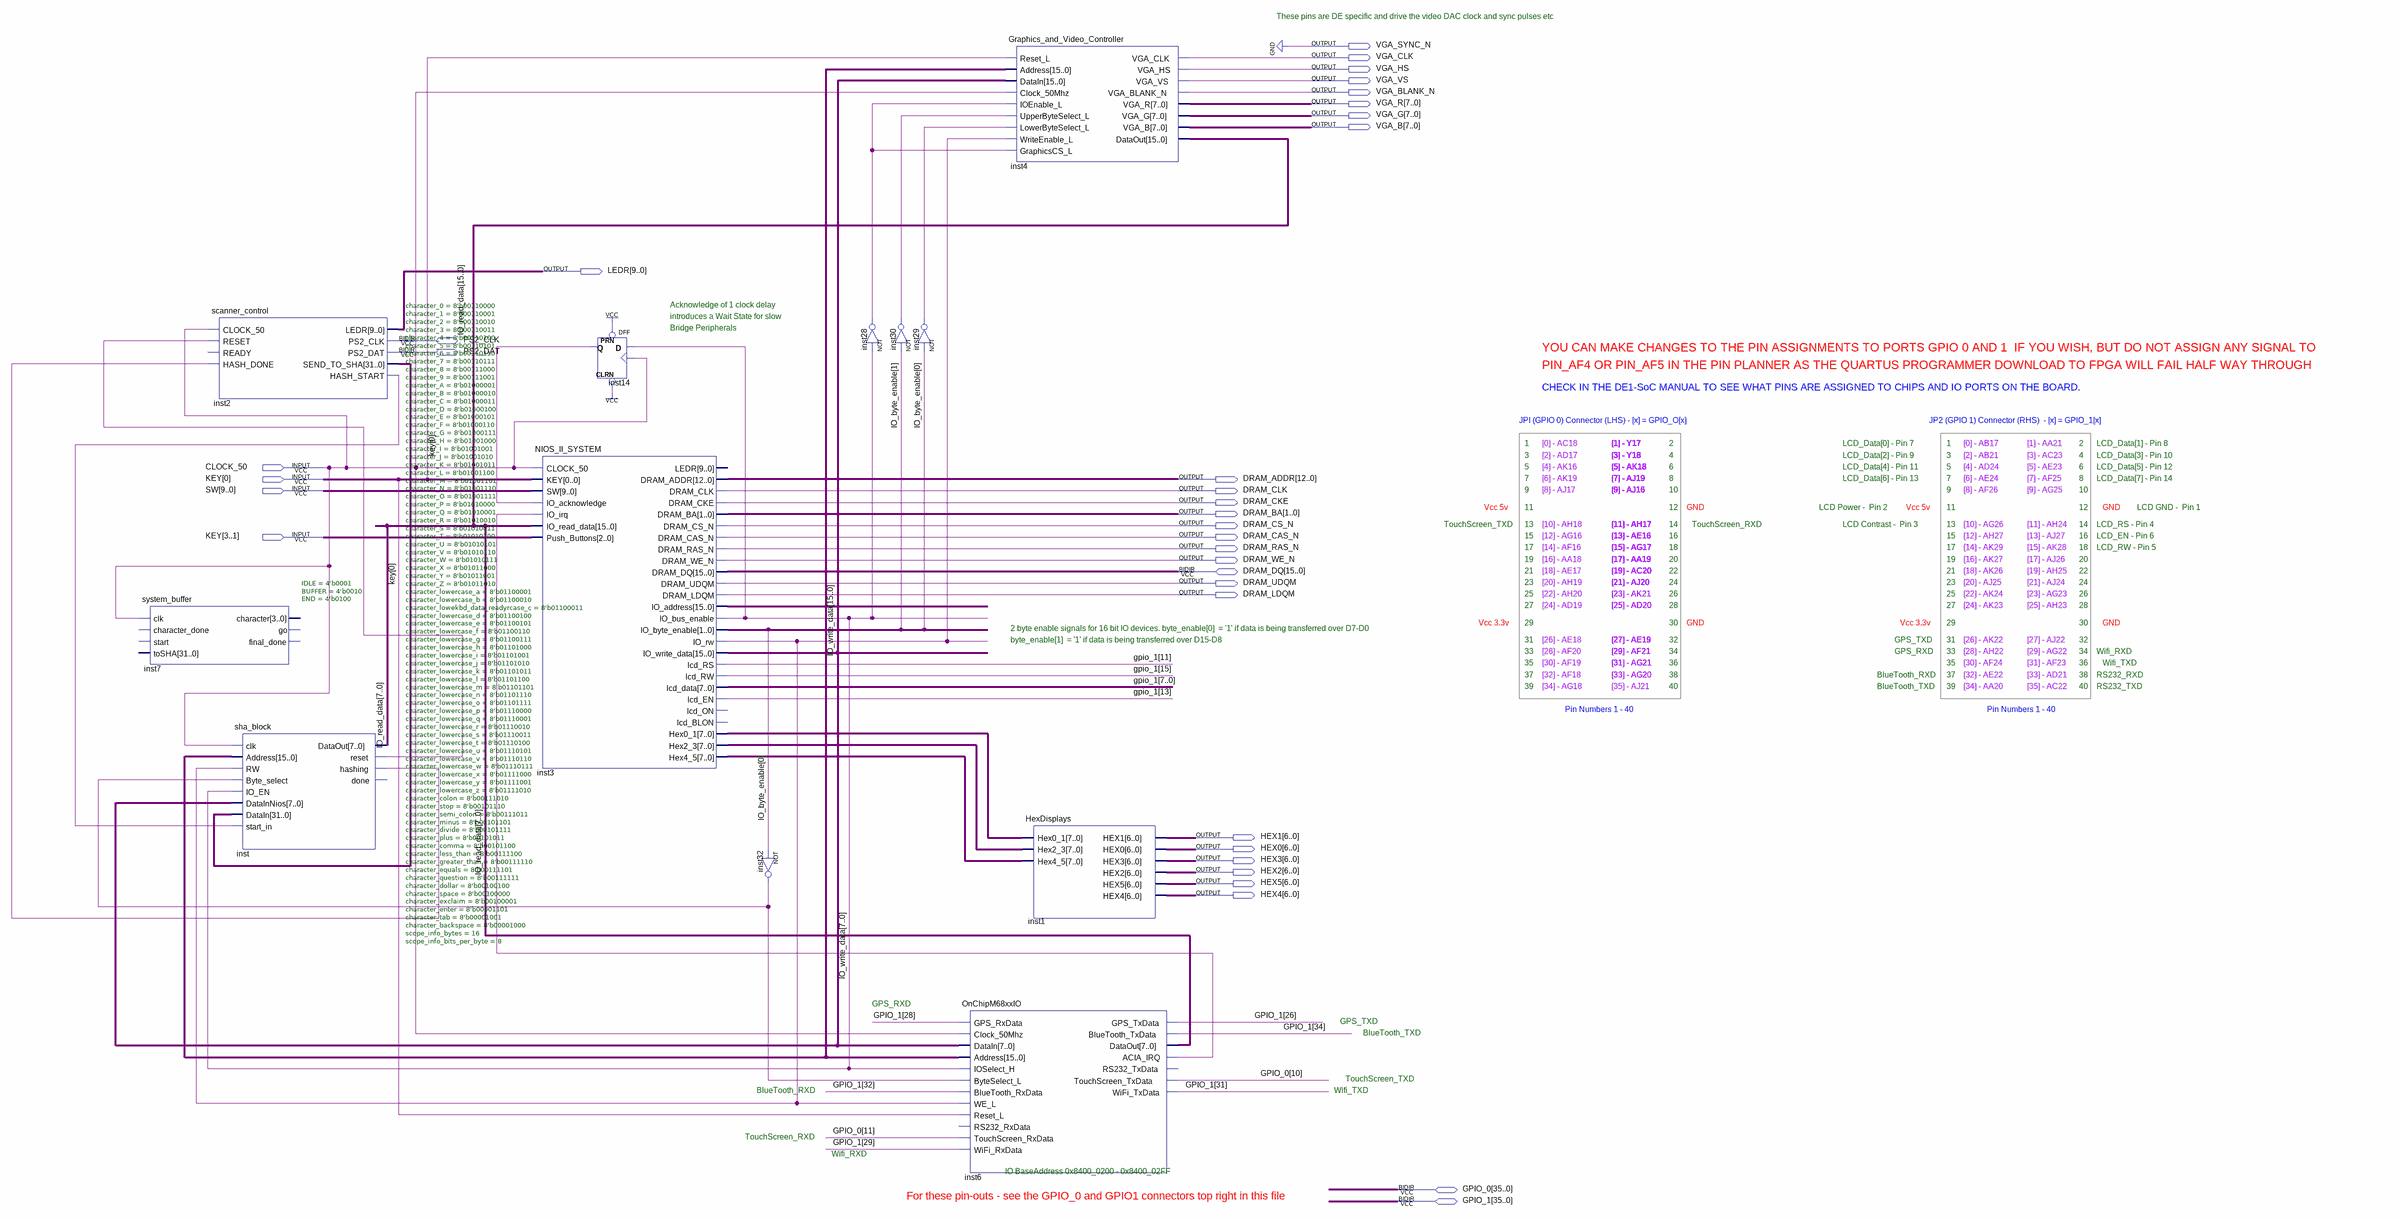
[diagram p0: schematic sheet]
// Quartus schematic Exercise14.bdf as structural Verilog: 12 symbols, 34 pins
module Exercise14 (
  input  CLOCK_50,
  input  [3:0] KEY,
  input  [9:0] SW,
  inout  PS2_CLK,
  inout  PS2_DAT,
  inout  [15:0] DRAM_DQ,
  inout  [35:0] GPIO_0,
  inout  [35:0] GPIO_1,
  output VGA_SYNC_N,
  output VGA_CLK,
  output VGA_HS,
  output VGA_VS,
  output VGA_BLANK_N,
  output [7:0] VGA_R,
  output [7:0] VGA_G,
  output [7:0] VGA_B,
  output [9:0] LEDR,
  output [12:0] DRAM_ADDR,
  output DRAM_CLK,
  output DRAM_CKE,
  output [1:0] DRAM_BA,
  output DRAM_CS_N,
  output DRAM_CAS_N,
  output DRAM_RAS_N,
  output DRAM_WE_N,
  output DRAM_UDQM,
  output DRAM_LDQM,
  output [6:0] HEX1,
  output [6:0] HEX0,
  output [6:0] HEX3,
  output [6:0] HEX2,
  output [6:0] HEX5,
  output [6:0] HEX4
);

  wire inst2_hash_start, inst3_io_bus_enable, inst3_io_rw, inst6_acia_irq, inst14_q, inst28_out, inst29_out,
       inst30_out, inst32_out, inst_hashing, inst_reset;
  wire [1:0] IO_byte_enable;
  wire [7:0] inst3_hex0_1, inst3_hex2_3, inst3_hex4_5;
  wire [15:0] inst3_io_address, IO_read_data, IO_write_data;
  wire [31:0] inst2_send_to_sha;

  system_buffer #(.IDLE(4'b0001), .BUFFER(4'b0010), .END(4'b0100)) inst7 (.clk(CLOCK_50));  // open: character_done, start, toSHA, character, go, final_done
  scanner_control #(.character_0(8'b00110000), .character_1(8'b00110001), .character_2(8'b00110010), .character_3(8'b00110011), .character_4(8'b00110100), .character_5(8'b00110101), .character_6(8'b00110110), .character_7(8'b00110111), .character_8(8'b00111000), .character_9(8'b00111001), .character_A(8'b01000001), .character_B(8'b01000010), .character_C(8'b01000011), .character_D(8'b01000100), .character_E(8'b01000101), .character_F(8'b01000110), .character_G(8'b01000111), .character_H(8'b01001000), .character_I(8'b01001001), .character_J(8'b01001010), .character_K(8'b01001011), .character_L(8'b01001100), .character_M(8'b01001101), .character_N(8'b01001110), .character_O(8'b01001111), .character_P(8'b01010000), .character_Q(8'b01010001), .character_R(8'b01010010), .character_S(8'b01010011), .character_T(8'b01010100), .character_U(8'b01010101), .character_V(8'b01010110), .character_W(8'b01010111), .character_X(8'b01011000), .character_Y(8'b01011001), .character_Z(8'b01011010), .character_lowercase_a(8'b01100001), .character_lowercase_b(8'b01100010), .character_lowekbd_data_readyrcase_c(8'b01100011), .character_lowercase_d(8'b01100100), .character_lowercase_e(8'b01100101), .character_lowercase_f(8'b01100110), .character_lowercase_g(8'b01100111), .character_lowercase_h(8'b01101000), .character_lowercase_i(8'b01101001), .character_lowercase_j(8'b01101010), .character_lowercase_k(8'b01101011), .character_lowercase_l(8'b01101100), .character_lowercase_m(8'b01101101), .character_lowercase_n(8'b01101110), .character_lowercase_o(8'b01101111), .character_lowercase_p(8'b01110000), .character_lowercase_q(8'b01110001), .character_lowercase_r(8'b01110010), .character_lowercase_s(8'b01110011), .character_lowercase_t(8'b01110100), .character_lowercase_u(8'b01110101), .character_lowercase_v(8'b01110110), .character_lowercase_w(8'b01110111), .character_lowercase_x(8'b01111000), .character_lowercase_y(8'b01111001), .character_lowercase_z(8'b01111010), .character_colon(8'b00111010), .character_stop(8'b00101110), .character_semi_colon(8'b00111011), .character_minus(8'b00101101), .character_divide(8'b00101111), .character_plus(8'b00101011), .character_comma(8'b00101100), .character_less_than(8'b00111100), .character_greater_than(8'b00111110), .character_equals(8'b00111101), .character_question(8'b00111111), .character_dollar(8'b00100100), .character_space(8'b00100000), .character_exclaim(8'b00100001), .character_enter(8'b00001101), .character_tab(8'b00001001), .character_backspace(8'b00001000), .scope_info_bytes(16), .scope_info_bits_per_byte(8)) inst2 (
    .CLOCK_50(CLOCK_50), .RESET(inst_reset), .HASH_DONE(inst_hashing), .LEDR(LEDR),
    .SEND_TO_SHA(inst2_send_to_sha), .HASH_START(inst2_hash_start), .PS2_CLK(PS2_CLK), .PS2_DAT(PS2_DAT));  // open: READY
  sha_block inst (
    .clk(CLOCK_50), .Address(inst3_io_address), .RW(inst3_io_rw), .Byte_select(inst32_out),
    .IO_EN(inst3_io_bus_enable), .DataInNios(IO_write_data[7:0]), .DataIn(inst2_send_to_sha),
    .start_in(inst2_hash_start), .DataOut(IO_read_data[7:0]), .reset(inst_reset), .hashing(inst_hashing));  // open: done
  NIOS_II_SYSTEM inst3 (
    .CLOCK_50(CLOCK_50), .KEY(KEY[0]), .SW(SW), .IO_acknowledge(inst14_q), .IO_irq(inst6_acia_irq),
    .IO_read_data(IO_read_data), .Push_Buttons(KEY[3:1]), .DRAM_ADDR(DRAM_ADDR), .DRAM_CLK(DRAM_CLK),
    .DRAM_CKE(DRAM_CKE), .DRAM_BA(DRAM_BA), .DRAM_CS_N(DRAM_CS_N), .DRAM_CAS_N(DRAM_CAS_N),
    .DRAM_RAS_N(DRAM_RAS_N), .DRAM_WE_N(DRAM_WE_N), .DRAM_UDQM(DRAM_UDQM), .DRAM_LDQM(DRAM_LDQM),
    .IO_address(inst3_io_address), .IO_bus_enable(inst3_io_bus_enable), .IO_byte_enable(IO_byte_enable),
    .IO_rw(inst3_io_rw), .IO_write_data(IO_write_data), .lcd_RS(GPIO_1[11]), .lcd_RW(GPIO_1[15]),
    .lcd_EN(GPIO_1[13]), .Hex0_1(inst3_hex0_1), .Hex2_3(inst3_hex2_3), .Hex4_5(inst3_hex4_5),
    .DRAM_DQ(DRAM_DQ), .lcd_data(GPIO_1[7:0]));  // open: LEDR, lcd_ON, lcd_BLON
  DFF inst14 (.CLRN(1'b1), .CLK(CLOCK_50), .D(inst3_io_bus_enable), .PRN(1'b1), .Q(inst14_q));
  not inst32 (inst32_out, IO_byte_enable[0]);
  not inst28 (inst28_out, inst3_io_bus_enable);
  not inst30 (inst30_out, IO_byte_enable[1]);
  not inst29 (inst29_out, IO_byte_enable[0]);
  OnChipM68xxIO inst6 (
    .GPS_RxData(GPIO_1[28]), .Clock_50Mhz(CLOCK_50), .DataIn(IO_write_data[7:0]), .Address(inst3_io_address),
    .IOSelect_H(inst3_io_bus_enable), .ByteSelect_L(inst32_out), .BlueTooth_RxData(GPIO_1[32]),
    .WE_L(inst3_io_rw), .Reset_L(KEY[0]), .TouchScreen_RxData(GPIO_0[11]), .WiFi_RxData(GPIO_1[29]),
    .GPS_TxData(GPIO_1[26]), .BlueTooth_TxData(GPIO_1[34]), .DataOut(IO_read_data[7:0]),
    .ACIA_IRQ(inst6_acia_irq), .TouchScreen_TxData(GPIO_0[10]), .WiFi_TxData(GPIO_1[31]));  // open: RS232_RxData, RS232_TxData
  Graphics_and_Video_Controller inst4 (
    .Reset_L(KEY[0]), .Address(inst3_io_address), .DataIn(IO_write_data), .Clock_50Mhz(CLOCK_50),
    .IOEnable_L(inst28_out), .UpperByteSelect_L(inst30_out), .LowerByteSelect_L(inst29_out),
    .WriteEnable_L(inst3_io_rw), .GraphicsCS_L(inst28_out), .VGA_CLK(VGA_CLK), .VGA_HS(VGA_HS),
    .VGA_VS(VGA_VS), .VGA_BLANK_N(VGA_BLANK_N), .VGA_R(VGA_R), .VGA_G(VGA_G), .VGA_B(VGA_B),
    .DataOut(IO_read_data));
  HexDisplays inst1 (
    .Hex0_1(inst3_hex0_1), .Hex2_3(inst3_hex2_3), .Hex4_5(inst3_hex4_5), .HEX1(HEX1), .HEX0(HEX0),
    .HEX3(HEX3), .HEX2(HEX2), .HEX5(HEX5), .HEX4(HEX4));

  assign VGA_SYNC_N = 1'b0;

  // Notes on the sheet:
  //   These pins are DE specific and drive the video DAC clock and sync pulses etc
  //   Acknowledge of 1 clock delay
  //   introduces a Wait State for slow
  //   Bridge Peripherals
  //   YOU CAN MAKE CHANGES TO THE PIN ASSIGNMENTS TO PORTS GPIO 0 AND 1  IF YOU WISH, BUT DO NOT ASSIGN ANY SIGNAL TO 
  //   PIN_AF4 OR PIN_AF5 IN THE PIN PLANNER AS THE QUARTUS PROGRAMMER DOWNLOAD TO FPGA WILL FAIL HALF WAY THROUGH
  //   CHECK IN THE DE1-SoC MANUAL TO SEE WHAT PINS ARE ASSIGNED TO CHIPS AND IO PORTS ON THE BOARD. 
  //   JPI (GPIO 0) Connector (LHS) - [x] = GPIO_O[x]
  //   JP2 (GPIO 1) Connector (RHS)  - [x] = GPIO_1[x]
  //   1
  //   [0] - AC18
  //   [1] - Y17
  //   [1] - Y17
  //   [1] - Y17
  //   [1] - Y17
  //   [1] - Y17
  //   [1] - Y17
  //   [1] - Y17
  //   [1] - Y17
  //   [1] - Y17
  //   [1] - Y17
  //   [1] - Y17
  //   [1] - Y17
  //   [1] - Y17
  //   [1] - Y17
  //   [1] - Y17
  //   [1] - Y17
  //   [1] - Y17
  //   [1] - Y17
  //   [1] - Y17
  //   2
  //   LCD_Data[0] - Pin 7
  //   1
  //   [0] - AB17
  //   [1] - AA21
  //   2
  //   LCD_Data[1] - Pin 8
  //   3
  //   [2] - AD17
  //   [3] - Y18
  //   [3] - Y18
  //   [3] - Y18
  //   [3] - Y18
  //   [3] - Y18
  //   [3] - Y18
  //   [3] - Y18
  //   [3] - Y18
  //   [3] - Y18
  //   [3] - Y18
  //   [3] - Y18
  //   [3] - Y18
  //   [3] - Y18
  //   [3] - Y18
  //   [3] - Y18
  //   [3] - Y18
  //   [3] - Y18
  //   [3] - Y18
  //   4
  //   LCD_Data[2] - Pin 9
  //   3
  //   [2] - AB21
  //   [3] - AC23
  //   4
  //   LCD_Data[3] - Pin 10
  //   5
  //   [4] - AK16
  //   [5] - AK18
  //   [5] - AK18
  //   [5] - AK18
  //   [5] - AK18
  //   [5] - AK18
  //   [5] - AK18
  //   [5] - AK18
  //   [5] - AK18
  //   [5] - AK18
  //   [5] - AK18
  //   [5] - AK18
  //   [5] - AK18
  //   [5] - AK18
  //   [5] - AK18
  //   [5] - AK18
  //   [5] - AK18
  //   6
  //   LCD_Data[4] - Pin 11
  //   5
  //   [4] - AD24
  //   [5] - AE23
  //   6
  //   LCD_Data[5] - Pin 12
  //   7
  //   [6] - AK19
  //   [7] - AJ19
  //   [7] - AJ19
  //   [7] - AJ19
  //   [7] - AJ19
  //   [7] - AJ19
  //   [7] - AJ19
  //   [7] - AJ19
  //   [7] - AJ19
  //   [7] - AJ19
  //   [7] - AJ19
  //   [7] - AJ19
  //   [7] - AJ19
  //   [7] - AJ19
  //   [7] - AJ19
  //   8
  //   LCD_Data[6] - Pin 13
  //   7
  //   [6] - AE24
  //   [7] - AF25
  //   8
  //   LCD_Data[7] - Pin 14
  //   9
  //   [8] - AJ17
  //   [9] - AJ16
  //   [9] - AJ16
  //   [9] - AJ16
  //   [9] - AJ16
  //   [9] - AJ16
  //   [9] - AJ16
  //   [9] - AJ16
  //   [9] - AJ16
  //   [9] - AJ16
  //   [9] - AJ16
  //   [9] - AJ16
  //   [9] - AJ16
  //   [9] - AJ16
  //   10
  //   9
  //   [8] - AF26
  //   [9] - AG25
  //   10
  //   Vcc 5v
  //   11
  //   12
  //   GND
  //   LCD Power -  Pin 2
  //   Vcc 5v
  //   11
  //   12
  //   GND
  //   LCD GND -  Pin 1
  //   TouchScreen_TXD
  //   13
  //   [10] - AH18
  //   [11] - AH17
  //   [11] - AH17
  //   [11] - AH17
  //   [11] - AH17
  //   [11] - AH17
  //   [11] - AH17
  //   [11] - AH17
  //   [11] - AH17
  //   [11] - AH17
  //   [11] - AH17
  //   [11] - AH17
  //   [11] - AH17
  //   14
  //   TouchScreen_RXD
  //   LCD Contrast -  Pin 3
  //   13
  //   [10] - AG26
  //   [11] - AH24
  //   14
  //   LCD_RS - Pin 4
  //   15
  //   [12] - AG16
  //   [13] - AE16
  //   [13] - AE16
  //   [13] - AE16
  //   [13] - AE16
  //   [13] - AE16
  //   [13] - AE16
  //   [13] - AE16
  //   [13] - AE16
  //   [13] - AE16
  //   [13] - AE16
  //   [13] - AE16
  //   16
  //   15
  //   [12] - AH27
  //   [13] - AJ27
  //   16
  //   LCD_EN - Pin 6
  //   17
  //   [14] - AF16
  //   [15] - AG17
  //   [15] - AG17
  //   [15] - AG17
  //   [15] - AG17
  //   [15] - AG17
  //   [15] - AG17
  //   [15] - AG17
  //   [15] - AG17
  //   [15] - AG17
  //   18
  //   17
  //   [14] - AK29
  //   [15] - AK28
  //   18
  //   LCD_RW - Pin 5
  //   19
  //   [16] - AA18
  //   [17] - AA19
  //   [17] - AA19
  //   [17] - AA19
  //   [17] - AA19
  //   [17] - AA19
  //   [17] - AA19
  //   [17] - AA19
  //   [17] - AA19
  //   [17] - AA19
  //   [17] - AA19
  //   20
  //   19
  //   [16] - AK27
  //   [17] - AJ26
  //   20
  //   21
  //   [18] - AE17
  //   [19] - AC20
  //   [19] - AC20
  //   [19] - AC20
  //   [19] - AC20
  //   [19] - AC20
  //   [19] - AC20
  //   [19] - AC20
  //   [19] - AC20
  //   22
  //   21
  //   [18] - AK26
  //   [19] - AH25
  //   22
  //   23
  //   [20] - AH19
  //   [21] - AJ20
  //   [21] - AJ20
  //   [21] - AJ20
  //   [21] - AJ20
  //   [21] - AJ20
  //   [21] - AJ20
  //   [21] - AJ20
  //   24
  //   23
  //   [20] - AJ25
  //   [21] - AJ24
  //   24
  //   25
  //   [22] - AH20
  //   [23] - AK21
  //   [23] - AK21
  //   26
  //   25
  //   [22] - AK24
  //   [23] - AG23
  //   26
  //   27
  //   [24] - AD19
  //   [25] - AD20
  //   [25] - AD20
  //   [25] - AD20
  //   28
  //   27
  //   [24] - AK23
  //   [25] - AH23
  //   28
  //   Vcc 3.3v
  //   29
  //   30
  //   GND
  //   Vcc 3.3v
  //   29
  //   30
  //   GND
  //   2 byte enable signals for 16 bit IO devices. byte_enable[0]  = '1' if data is being transferred over D7-D0
  //   byte_enable[1]  = '1' if data is being transferred over D15-D8
  //   31
  //   [26] - AE18
  //   [27] - AE19
  //   [27] - AE19
  //   [27] - AE19
  //   [27] - AE19
  //   [27] - AE19
  //   32
  //   GPS_TXD
  //   31
  //   [26] - AK22
  //   [27] - AJ22
  //   32
  //   33
  //   [28] - AF20
  //   [29] - AF21
  //   [29] - AF21
  //   [29] - AF21
  //   [29] - AF21
  //   34
  //   GPS_RXD
  //   33
  //   [28] - AH22
  //   [29] - AG22
  //   34
  //   Wifi_RXD
  //   35
  //   [30] - AF19
  //   [31] - AG21
  //   [31] - AG21
  //   [31] - AG21
  //   36
  //   35
  //   [30] - AF24
  //   [31] - AF23
  //   36
  //   Wifi_TXD
  //   37
  //   [32] - AF18
  //   [33] - AG20
  //   [33] - AG20
  //   38
  //   BlueTooth_RXD
  //   37
  //   [32] - AE22
  //   [33] - AD21
  //   38
  //   RS232_RXD
  //   39
  //   [34] - AG18
  //   [35] - AJ21
  //   40
  //   BlueTooth_TXD
  //   39
  //   [34] - AA20
  //   [35] - AC22
  //   40
  //   RS232_TXD
  //   Pin Numbers 1 - 40
  //   Pin Numbers 1 - 40
  //   GPS_RXD
  //   GPS_TXD
  //   BlueTooth_TXD
  //   TouchScreen_TXD
  //   BlueTooth_RXD
  //   Wifi_TXD
  //   TouchScreen_RXD
  //   Wifi_RXD
  //   IO BaseAddress 0x8400_0200 - 0x8400_02FF
  //   For these pin-outs - see the GPIO_0 and GPIO1 connectors top right in this file
endmodule
